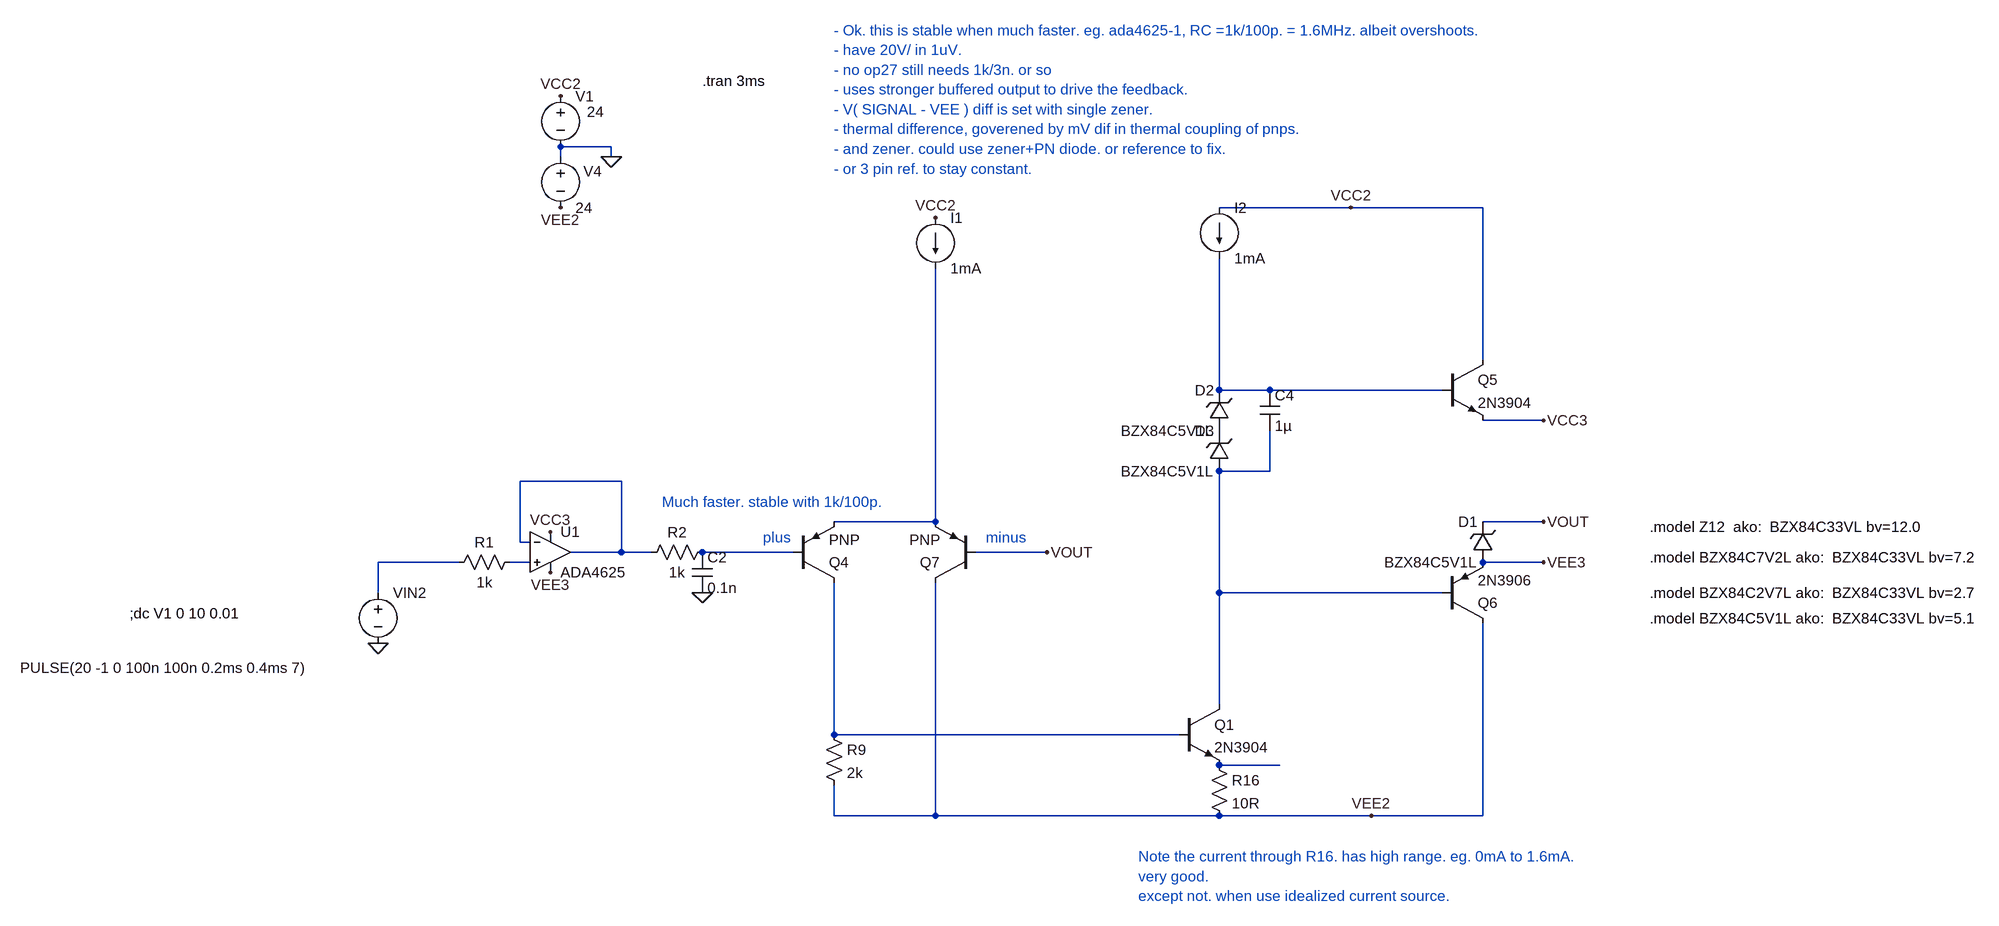
[diagram p0: schematic Draft50.asc]
Draft50.asc, the LTspice schematic file:
Version 4
SHEET 1 1948 952
WIRE -256 -288 -336 -288
WIRE -336 -272 -336 -288
WIRE -256 -272 -256 -288
WIRE 912 -192 704 -192
WIRE 1120 -192 912 -192
WIRE 1120 48 1120 -192
WIRE 704 96 704 -112
WIRE 784 96 704 96
WIRE 1056 96 784 96
WIRE 1216 144 1120 144
WIRE 784 224 784 160
WIRE 784 224 704 224
WIRE -240 240 -400 240
WIRE 256 304 256 -96
WIRE 256 304 96 304
WIRE 1216 304 1120 304
WIRE -400 336 -400 240
WIRE -384 336 -400 336
WIRE -240 352 -240 240
WIRE -240 352 -320 352
WIRE -192 352 -240 352
WIRE 32 352 -112 352
WIRE 432 352 320 352
WIRE -496 368 -624 368
WIRE -384 368 -416 368
WIRE 1216 368 1120 368
WIRE -624 416 -624 368
WIRE 704 416 704 224
WIRE 1056 416 704 416
WIRE 704 592 704 416
WIRE 96 640 96 400
WIRE 640 640 96 640
WIRE 800 688 704 688
WIRE 96 768 96 720
WIRE 256 768 256 400
WIRE 256 768 96 768
WIRE 704 768 256 768
WIRE 944 768 704 768
WIRE 1120 768 1120 464
WIRE 1120 768 944 768
FLAG -256 -272 0
FLAG -336 -368 VCC2
FLAG -336 -192 VEE2
FLAG 912 -192 VCC2
FLAG 944 768 VEE2
FLAG 1216 304 VOUT
FLAG 256 -176 VCC2
FLAG -624 496 0
FLAG 1216 144 VCC3
FLAG 1216 368 VEE3
FLAG -352 320 VCC3
FLAG -352 384 VEE3
FLAG -112 416 0
FLAG 432 352 VOUT
SYMBOL voltage -336 -384 R0
WINDOW 123 0 0 Left 0
WINDOW 39 0 0 Left 0
WINDOW 3 42 41 Left 2
SYMATTR Value 24
SYMATTR InstName V1
SYMBOL voltage -336 -288 R0
WINDOW 123 0 0 Left 0
WINDOW 39 0 0 Left 0
WINDOW 0 36 39 Left 2
SYMATTR InstName V4
SYMATTR Value 24
SYMBOL npn 1056 48 R0
SYMATTR InstName Q5
SYMATTR Value 2N3904
SYMBOL pnp 1056 464 M180
SYMATTR InstName Q6
SYMATTR Value 2N3906
SYMBOL res 80 624 R0
SYMATTR InstName R9
SYMATTR Value 2k
SYMBOL res 688 672 R0
SYMATTR InstName R16
SYMATTR Value 10R
SYMBOL pnp 32 400 M180
SYMATTR InstName Q4
SYMBOL pnp 320 400 R180
SYMATTR InstName Q7
SYMBOL current 256 -176 R0
WINDOW 123 0 0 Left 0
WINDOW 39 0 0 Left 0
SYMATTR InstName I1
SYMATTR Value 1mA
SYMBOL current 704 -192 R0
WINDOW 123 0 0 Left 0
WINDOW 39 0 0 Left 0
SYMATTR InstName I2
SYMATTR Value 1mA
SYMBOL voltage -624 400 R0
WINDOW 123 0 0 Left 0
WINDOW 39 0 0 Left 0
WINDOW 3 -565 134 Left 2
SYMATTR Value PULSE(20 -1 0 100n 100n 0.2ms 0.4ms 7)
SYMATTR InstName VIN2
SYMBOL res -400 352 R90
WINDOW 0 0 56 VBottom 2
WINDOW 3 32 56 VTop 2
SYMATTR InstName R1
SYMATTR Value 1k
SYMBOL res -96 336 R90
WINDOW 0 0 56 VBottom 2
WINDOW 3 32 56 VTop 2
SYMATTR InstName R2
SYMATTR Value 1k
SYMBOL cap -128 352 R0
SYMATTR InstName C2
SYMATTR Value 0.1n
SYMBOL cap 768 96 R0
SYMATTR InstName C4
SYMATTR Value 1µ
SYMBOL OpAmps\\ADA4625 -352 288 R0
SYMATTR InstName U1
SYMBOL zener 1136 368 R180
WINDOW 0 24 64 Left 2
WINDOW 3 24 0 Left 2
SYMATTR InstName D1
SYMATTR Value BZX84C5V1L
SYMBOL zener 720 160 R180
WINDOW 0 24 64 Left 2
WINDOW 3 24 0 Left 2
SYMATTR InstName D2
SYMATTR Value BZX84C5V1L
SYMBOL zener 720 224 R180
WINDOW 0 24 64 Left 2
WINDOW 3 24 0 Left 2
SYMATTR InstName D3
SYMATTR Value BZX84C5V1L
SYMBOL npn 640 592 R0
SYMATTR InstName Q1
SYMATTR Value 2N3904
TEXT -112 -392 Left 2 !.tran 3ms
TEXT 336 328 Left 2 ;minus
TEXT 576 832 Left 2 ;Note the current through R16. has high range. eg. 0mA to 1.6mA.\nvery good.\nexcept not. when use idealized current source.
TEXT -1016 448 Left 2 !;dc V1 0 10 0.01
TEXT -16 328 Left 2 ;plus
TEXT 1384 416 Left 2 !.model BZX84C2V7L ako:  BZX84C33VL bv=2.7
TEXT 1384 456 Left 2 !.model BZX84C5V1L ako:  BZX84C33VL bv=5.1
TEXT 1384 360 Left 2 !.model BZX84C7V2L ako:  BZX84C33VL bv=7.2
TEXT 1384 312 Left 2 !.model Z12  ako:  BZX84C33VL bv=12.0
TEXT 96 -472 Left 2 ;- Ok. this is stable when much faster. eg. ada4625-1, RC =1k/100p. = 1.6MHz. albeit overshoots.\n- have 20V/ in 1uV.\n- no op27 still needs 1k/3n. or so\n- uses stronger buffered output to drive the feedback.\n- V( SIGNAL - VEE ) diff is set with single zener.\n- thermal difference, goverened by mV dif in thermal coupling of pnps.\n- and zener. could use zener+PN diode. or reference to fix.\n- or 3 pin ref. to stay constant.
TEXT -176 272 Left 2 ;Much faster. stable with 1k/100p.

The netlist it stands for:
* Draft50.asc
V1 VCC2 0 24
V4 0 VEE2 24
Q5 VCC2 N001 VCC3 0 2N3904
Q6 VEE2 N002 VEE3 0 2N3906
R9 N008 VEE2 2k
R16 N009 VEE2 10R
Q4 N008 N005 N004 0 PNP
Q7 VEE2 VOUT N004 0 PNP
I1 VCC2 N004 1mA
I2 VCC2 N001 1mA
VIN2 N006 0 PULSE(20 -1 0 100n 100n 0.2ms 0.4ms 7)
R1 N007 N006 1k
R2 N005 N003 1k
C2 N005 0 0.1n
C4 N001 N002 1µ
XU1 N007 N003 VCC3 VEE3 N003 ADA4625  ; pins In+ In- V+ V- OUT
D1 VEE3 VOUT BZX84C5V1L
D2 P001 N001 BZX84C5V1L
D3 N002 P001 BZX84C5V1L
Q1 N002 N008 N009 0 2N3904
.model D D
.lib standard.dio
.model NPN NPN
.model PNP PNP
.lib standard.bjt
.tran 3ms
* minus
* Note the current through R16. has high range. eg. 0mA to 1.6mA.
* very good.
* except not. when use idealized current source.
;dc V1 0 10 0.01
* plus
.model BZX84C2V7L ako:  BZX84C33VL bv=2.7
.model BZX84C5V1L ako:  BZX84C33VL bv=5.1
.model BZX84C7V2L ako:  BZX84C33VL bv=7.2
.model Z12  ako:  BZX84C33VL bv=12.0
* - Ok. this is stable when much faster. eg. ada4625-1, RC =1k/100p. = 1.6MHz. albeit overshoots.
* - have 20V/ in 1uV.
* - no op27 still needs 1k/3n. or so
* - uses stronger buffered output to drive the feedback.
* - V( SIGNAL - VEE ) diff is set with single zener.
* - thermal difference, goverened by mV dif in thermal coupling of pnps.
* - and zener. could use zener+PN diode. or reference to fix.
* - or 3 pin ref. to stay constant.
* Much faster. stable with 1k/100p.
.backanno
.end